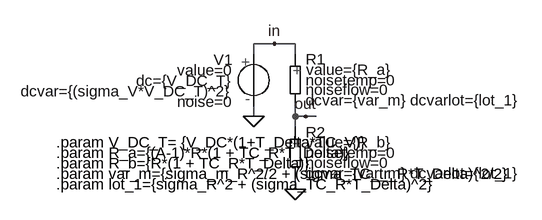
[diagram p0: schematic dcMatchingTracking.asc]
dcMatchingTracking.asc, the LTspice schematic file:
Version 4
SHEET 1 1180 680
WIRE 368 -240 336 -240
WIRE 400 -240 368 -240
WIRE 336 -224 336 -240
WIRE 400 -224 400 -240
WIRE 336 -128 336 -144
WIRE 400 -128 400 -144
WIRE 416 -128 400 -128
WIRE 432 -128 416 -128
WIRE 400 -112 400 -128
WIRE 400 -16 400 -32
FLAG 400 -16 0
FLAG 416 -128 out
FLAG 336 -128 0
FLAG 368 -240 in
SYMBOL SLV 336 -224 M0
SYMATTR InstName V1
SYMATTR Value2 dc={V_DC_T}
SYMATTR SpiceLine dcvar={(sigma_V*V_DC_T)^2}
SYMBOL SLR 400 -224 R0
SYMATTR InstName R1
SYMATTR Value value={R_a}
SYMATTR SpiceLine2 dcvar={var_m} dcvarlot={lot_1}
SYMBOL SLR 400 -112 R0
SYMATTR InstName R2
SYMATTR Value value={R_b}
SYMATTR SpiceLine2 dcvar={var_m} dcvarlot={lot_1}
TEXT 32 -72 Left 2 !.param R_a={(A-1)*R*(1 + TC_R*T_Delta)}
TEXT 32 -40 Left 2 !.param var_m={sigma_m_R^2/2 + (sigma_TC_tr_R*T_Delta)^2/2}
TEXT 32 -24 Left 2 !.param lot_1={sigma_R^2 + (sigma_TC_R*T_Delta)^2}
TEXT 32 -56 Left 2 !.param R_b={R*(1 + TC_R*T_Delta)}
TEXT 32 -88 Left 2 !.param V_DC_T= {V_DC*(1+T_Delta*TC_V)}

The netlist it stands for:
* dcMatchingTracking.asc
V1 in 0 V value=0 dc={V_DC_T} dcvar={(sigma_V*V_DC_T)^2} noise=0
R1 in out R value={R_a} noisetemp=0 noiseflow=0 dcvar={var_m} dcvarlot={lot_1}
R2 out 0 R value={R_b} noisetemp=0 noiseflow=0 dcvar={var_m} dcvarlot={lot_1}
.param R_a={(A-1)*R*(1 + TC_R*T_Delta)}
.param var_m={sigma_m_R^2/2 + (sigma_TC_tr_R*T_Delta)^2/2}
.param lot_1={sigma_R^2 + (sigma_TC_R*T_Delta)^2}
.param R_b={R*(1 + TC_R*T_Delta)}
.param V_DC_T= {V_DC*(1+T_Delta*TC_V)}
.backanno
.end